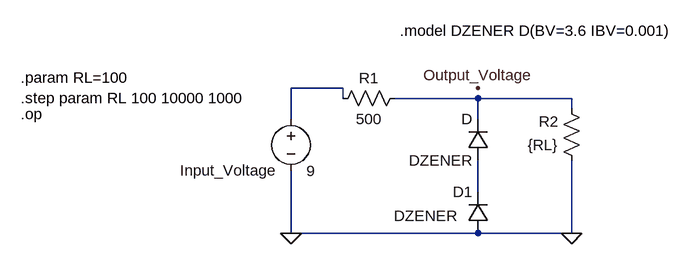
[diagram p0: schematic SECOND.asc]
SECOND.asc, the LTspice schematic file:
Version 4.1
SHEET 1 880 680
WIRE -16 64 -96 64
WIRE -16 80 -16 64
WIRE 192 80 64 80
WIRE 336 80 192 80
WIRE 336 96 336 80
WIRE -96 112 -96 64
WIRE 192 112 192 80
WIRE 192 224 192 176
WIRE -96 288 -96 192
WIRE 192 288 -96 288
WIRE 336 288 336 176
WIRE 336 288 192 288
FLAG -96 288 0
FLAG 336 288 0
FLAG 192 64 Output_Voltage
SYMBOL res 80 64 R90
WINDOW 0 0 56 VBottom 2
WINDOW 3 32 56 VTop 2
SYMATTR InstName R1
SYMATTR Value 500
SYMBOL res 352 192 R180
WINDOW 0 36 76 Left 2
WINDOW 3 36 40 Left 2
SYMATTR InstName R2
SYMATTR Value {RL}
SYMBOL diode 208 176 R180
WINDOW 0 24 64 Left 2
WINDOW 3 24 0 Left 2
SYMATTR InstName D
SYMATTR Value DZENER
SYMBOL voltage -96 96 R0
WINDOW 123 0 0 Left 0
WINDOW 39 0 0 Left 0
WINDOW 0 -171 95 Left 2
SYMATTR InstName Input_Voltage
SYMATTR Value 9
SYMBOL diode 208 288 R180
WINDOW 0 24 64 Left 2
WINDOW 3 47 27 Left 2
SYMATTR InstName D1
SYMATTR Value DZENER
TEXT 72 -24 Left 2 !.model DZENER D(BV=3.6 IBV=0.001)
TEXT -512 48 Left 2 !.param RL=100\n.step param RL 100 10000 1000
TEXT -512 104 Left 2 !.op

The netlist it stands for:
* SECOND.asc
R1 N002 N001 500
R2 0 N002 {RL}
D N003 N002 DZENER
V§Input_Voltage N001 0 9
D1 0 N003 DZENER
.model D D
.lib standard.dio
.model DZENER D(BV=3.6 IBV=0.001)
.param RL=100
.step param RL 100 10000 1000
.op
.backanno
.end